# EAGLE schematic CON_Board_v2 (EAGLE 7.3.0)
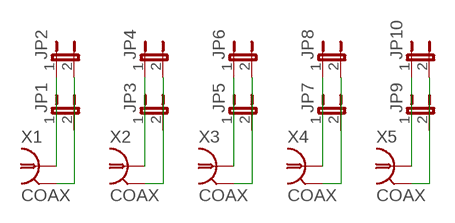
[diagram p0: schematic, sheet 1]

## Parts
JP1  JP1E  [JP1]
JP2  JP1E  [JP1]
JP3  JP1E  [JP1]
JP4  JP1E  [JP1]
JP5  JP1E  [JP1]
JP6  JP1E  [JP1]
JP7  JP1E  [JP1]
JP8  JP1E  [JP1]
JP9  JP1E  [JP1]
JP10  JP1E  [JP1]
X1  COAX  31-5329-52RFX31-5329-52RFX  [31-5329]
X2  COAX  31-5329-52RFX31-5329-52RFX  [31-5329]
X3  COAX  31-5329-52RFX31-5329-52RFX  [31-5329]
X4  COAX  31-5329-52RFX31-5329-52RFX  [31-5329]
X5  COAX  31-5329-52RFX31-5329-52RFX  [31-5329]

## Nets
N$1: JP1.1 JP2.1 X1.1
N$2: JP1.2 JP2.2 X1.2 X1.3 X1.4 X1.5
N$3: JP3.1 JP4.1 X2.1
N$4: JP3.2 JP4.2 X2.2 X2.3 X2.4 X2.5
N$5: JP5.1 JP6.1 X3.1
N$6: JP5.2 JP6.2 X3.2 X3.3 X3.4 X3.5
N$7: JP7.1 JP8.1 X4.1
N$8: JP7.2 JP8.2 X4.2 X4.3 X4.4 X4.5
N$9: JP9.1 JP10.1 X5.1
N$10: JP9.2 JP10.2 X5.2 X5.3 X5.4 X5.5

## Library data of the parts
JP1-JP10 = jumper:JP1E: JUMPER
X1-X5 = Amphenol-coax-connector:31-5329-52RFX; OC_FARNELL: unknown; OC_NEWARK: unknown